# Altium project ESP32USBC.PrjPcb (part 2 of 2)
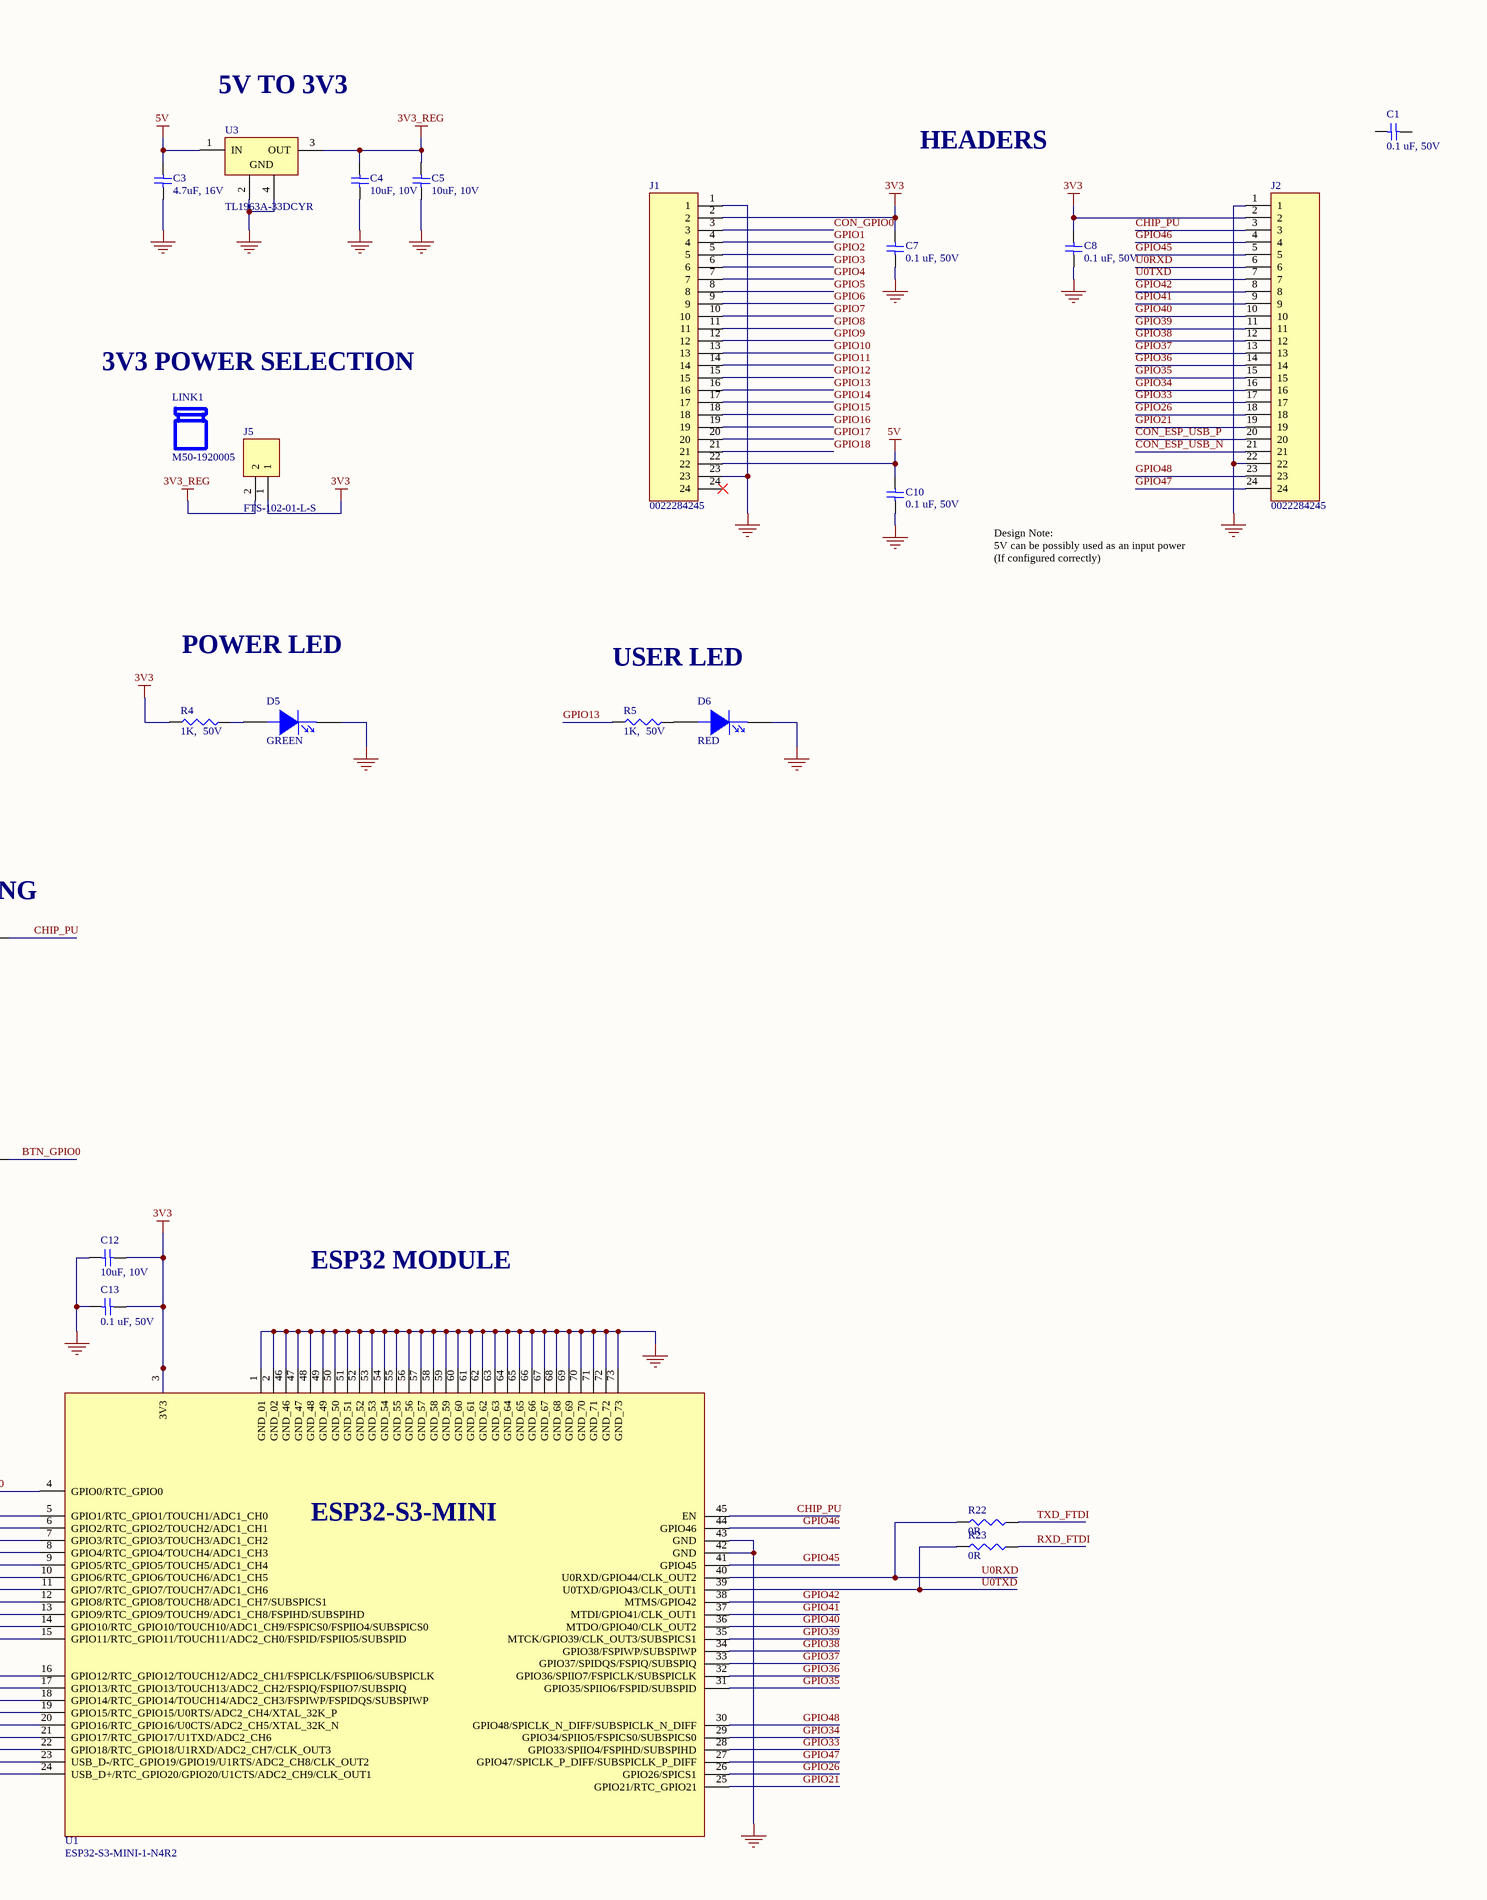
[diagram p2: ESP32USBC.SchDoc, right]

## Assembly variants
Prototype: not fitted C2 C17 R13 R14 R21 R27 R28